# Altium schematic sheet [01] Cover_page.SchDoc: =PCBProjectName +' Board'
size A3; Engineer: M. Folejewski; DocumentNumber: 1; SheetNumber: 1; SheetTotal: 4; Designators: -; PageSize: A3
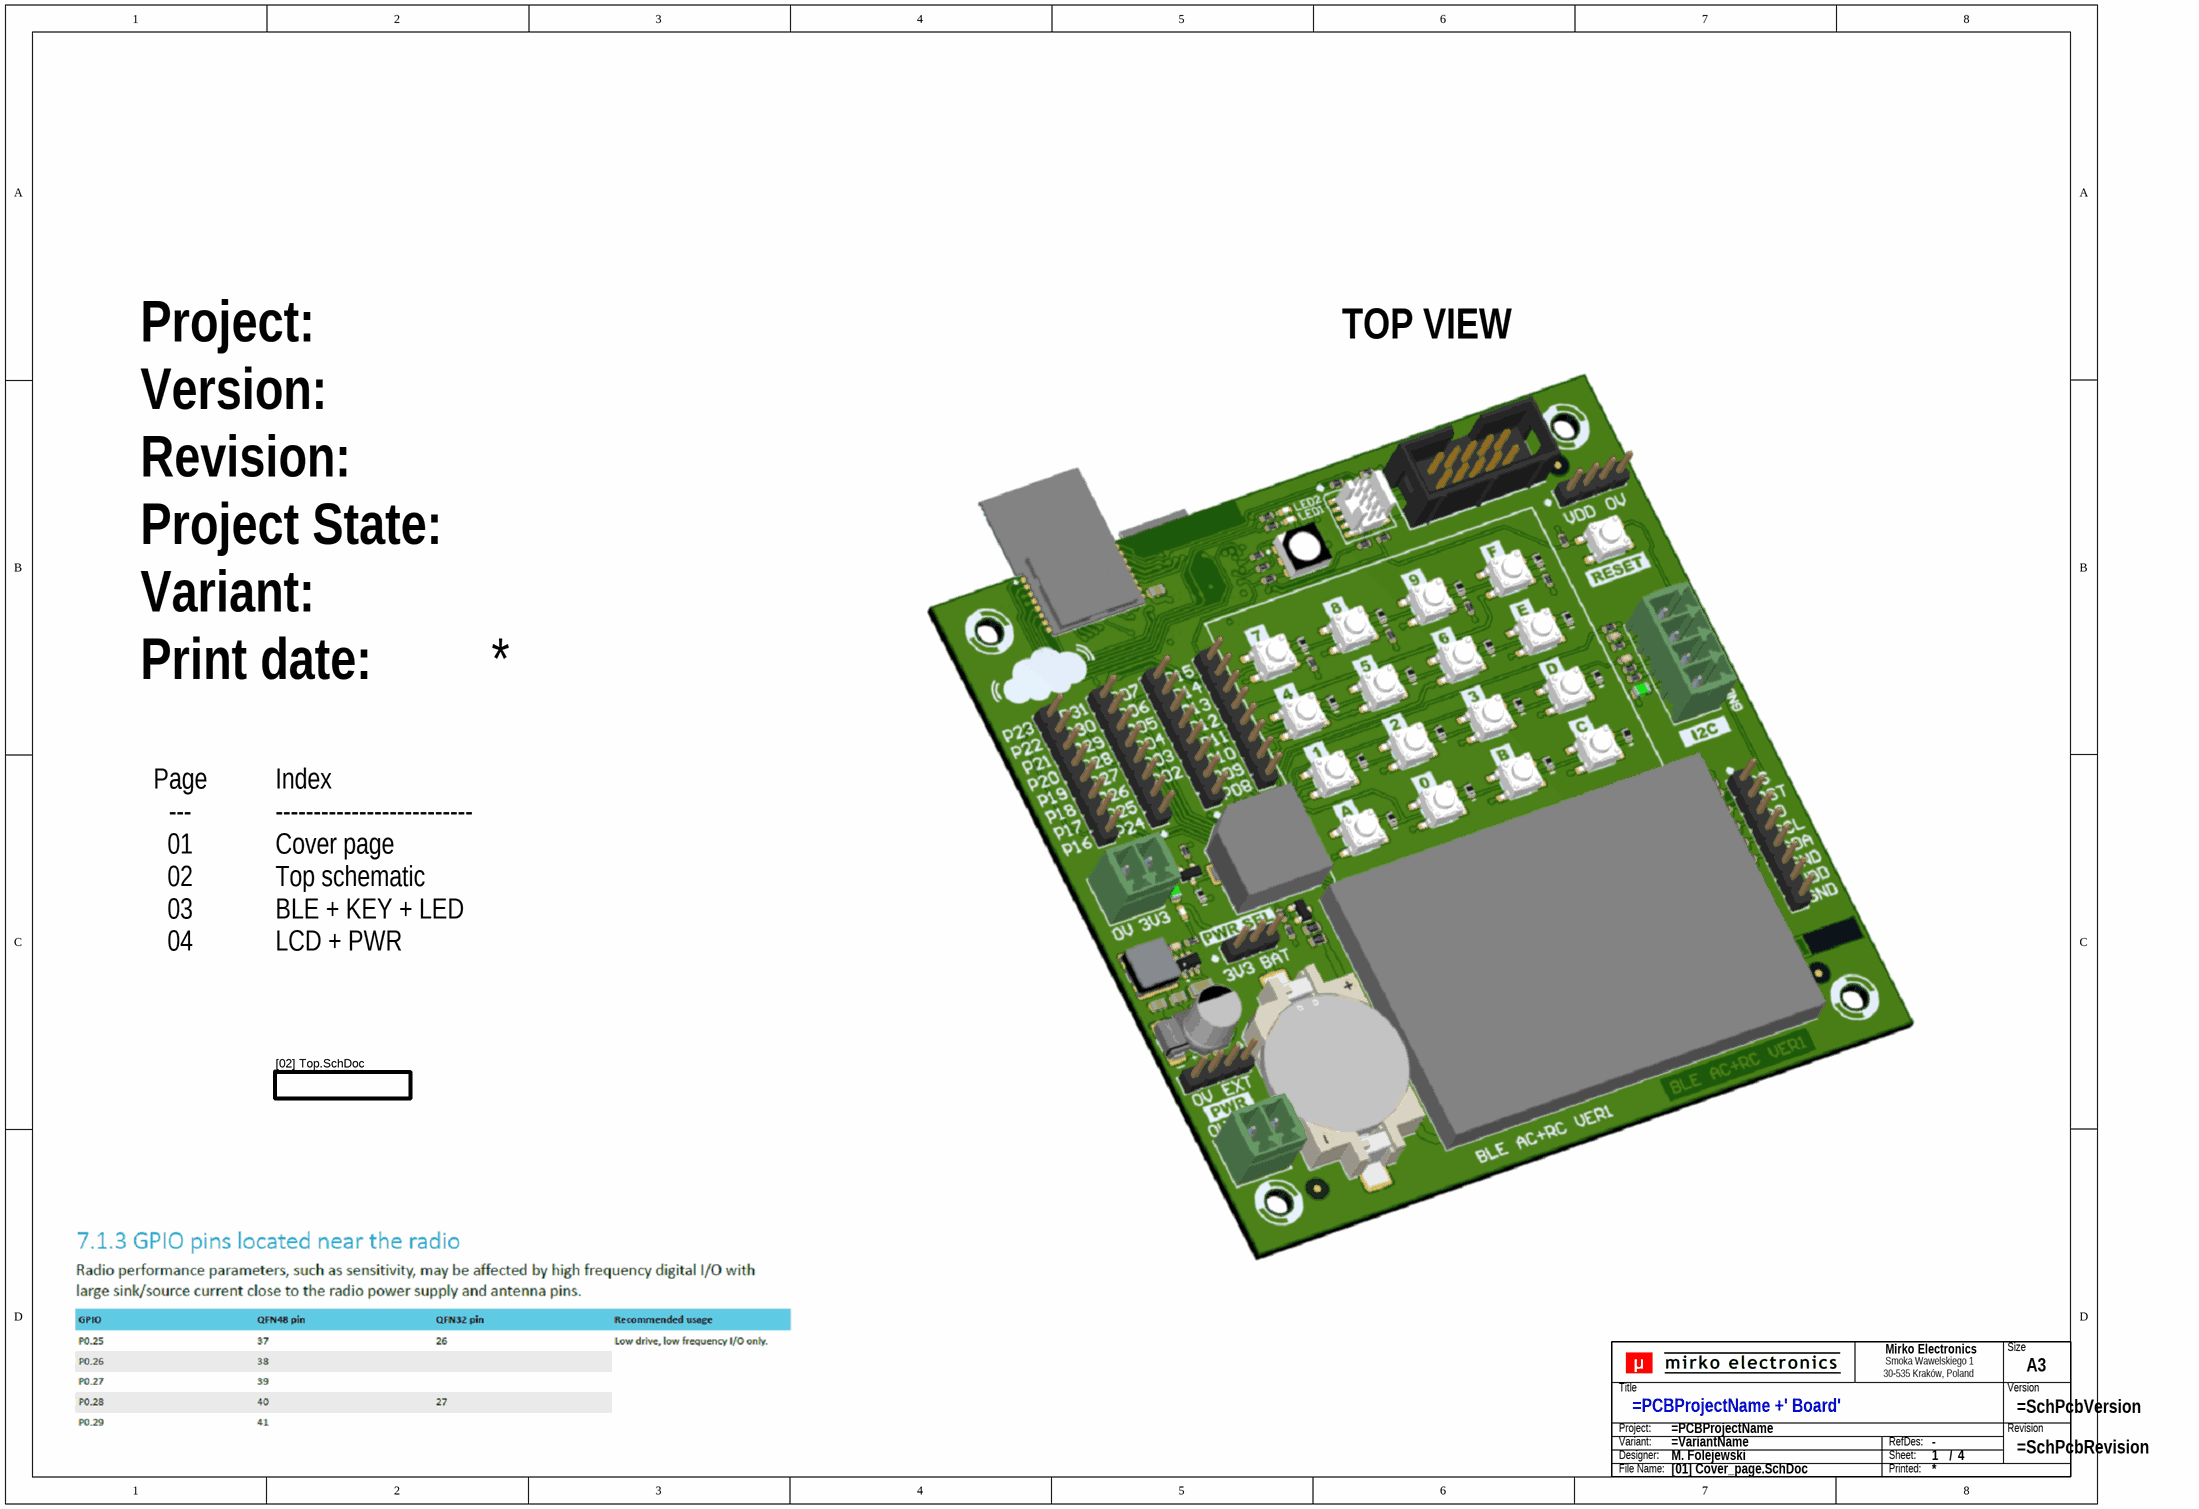
[diagram p0: [01] Cover_page.SchDoc]

## Parts
TB?  Title block  (value not drawn)  (graphical)

## Sub-sheets
D8 = [02] Top.SchDoc: no entries

## Notes on the sheet
- Project:
- TOP VIEW
- Version:
- Revision:
- Project State:
- Variant:
- Print date:
- Page
  ---
  01
  02
  03
  04
- Index
  --------------------------
  Cover page
  Top schematic
  BLE + KEY + LED
  LCD + PWR
- (in symbol SCH_TITLE_BLOCK_V1) Mirko Electronics; Size; Smoka Wawelskiego 1; 30-535 Kraków, Poland; Title; Version; Project:; Revision; Variant:; RefDes:; Designer:; Sheet:; /; File Name:; Printed:

## Library data of the parts
TB? = SCH_TITLE_BLOCK_V1: Component Type: Title block; Manufacturer: -; Mounting Type: Non component; MPN: -; Operating Temperature: -; Package: -; Specification: Title block; Value: Title block; Replacement: -; System: ?